# Altium schematic sheet Sheet1.SchDoc
size B
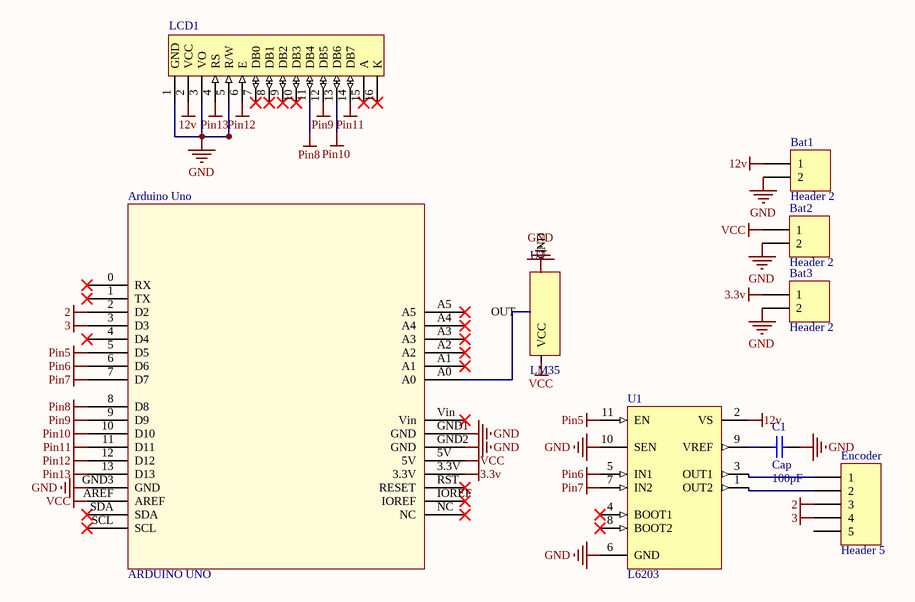
[diagram p0: Sheet1.SchDoc]

## Parts
Arduino_Uno  ARDUINO UNO  [ARDUINO UNO]
Bat1  Header 2  [HDR1X2]
Bat2  Header 2  [HDR1X2]
Bat3  Header 2  [HDR1X2]
C1  Cap  value 100pF  [RAD-0.3]
Encoder  Header 5  [HDR1X5]
LCD1  LCD 16X2  [My_LCD 16x2-A]  (value not drawn)
U1  L6203  [Multiwatt11]
U2  LM35  [LM35]

## Nets
2: Arduino_Uno.2(D2) Encoder.3
3: Arduino_Uno.3(D3) Encoder.4
3.3v: Arduino_Uno.3.3V Bat3.1
12v: Bat1.1 LCD1.2(VCC) U1.2(VS)
GND: Arduino_Uno.GND1(GND) Arduino_Uno.GND2(GND) Arduino_Uno.GND3(GND) Bat1.2 Bat2.2 Bat3.2 C1.2 LCD1.1(GND) LCD1.3(VO) LCD1.5(R/W) U1.6(GND) U1.10(SEN) U2.2(GND)
Pin5: Arduino_Uno.5(D5) U1.11(EN)
Pin6: Arduino_Uno.6(D6) U1.5(IN1)
Pin7: Arduino_Uno.7(D7) U1.7(IN2)
Pin8: Arduino_Uno.8(D8) LCD1.11(DB4)
Pin9: Arduino_Uno.9(D9) LCD1.12(DB5)
Pin10: Arduino_Uno.10(D10) LCD1.13(DB6)
Pin11: Arduino_Uno.11(D11) LCD1.14(DB7)
Pin12: Arduino_Uno.12(D12) LCD1.6(E)
Pin13: Arduino_Uno.13(D13) LCD1.4(RS)
VCC: Arduino_Uno.5V Arduino_Uno.AREF Bat2.1 U2.1(VCC)
NetArduino_Uno_A0: Arduino_Uno.A0 U2.3(OUT)
NetC1_1: C1.1 U1.9(VREF)
NetEncoder_1: Encoder.1 U1.3(OUT1)
NetEncoder_2: Encoder.2 U1.1(OUT2)

Not connected (* = marked no-connect by the designer): Arduino_Uno 0(RX)* 1(TX)* 4(D4)* A1* A2* A3* A4* A5* IOREF* NC* RST(RESET)* SCL* SDA* Vin*; Encoder 5; LCD1 7(DB0)* 8(DB1)* 9(DB2)* 10(DB3)* 15(A)* 16(K)*; U1 4(BOOT1)* 8(BOOT2)*

## Library data of the parts
Bat1-Bat3 = Header 2: Header, 2-Pin; LatestRevisionDate: 17-Jul-2002; LatestRevisionNote: Re-released for DXP Platform.; Publisher: Altium Limited
C1 = Cap: Capacitor; Published: 8-Jun-2000; LatestRevisionDate: 17-Jul-2002; LatestRevisionNote: Re-released for DXP Platform.; PackageReference: RAD-0.3; Publisher: Altium Limited; PackageDescription: Radial Cap, Thru-Hole; 2 Leads; 0.3 in Pin Spacing
Encoder = Header 5: Header, 5-Pin; LatestRevisionDate: 17-Jul-2002; LatestRevisionNote: Re-released for DXP Platform.; Publisher: Altium Limited
LCD1 = LCD 16X2: LCD 16X2 Character lcd
U1 = L6203: DMOS Full Bridge Driver; Note: TAB connected to pin 6; Published: 8-Jun-2000; LatestRevisionDate: 17-Jul-2002; LatestRevisionNote: Re-released for DXP Platform.; DatasheetVersion: Jul-1997; PackageReference: Multiwatt11; Publisher: Altium Limited; PackageDescription: TO, Thru-Hole, Vertical, Heatsink Mounted; 11 Bent Staggered Leads; Pitch 1.7 mm; ComponentLink1Description: Manufacturer Link; ComponentLink1URL: http://www.st.com/; ComponentLink2Description: Datasheet; ComponentLink2URL: http://www.st.com/stonline/products/literature/ds/1373/l6201.pdf